# Altium schematic sheet Sheet5.SchDoc: solar-powered-remote-water-level-relay
size 419 x 297 mm; Date: 2026/06/29; Author: forlook88@gmail.com; Revision: 0; SheetNumber: 5; SheetTotal: 11
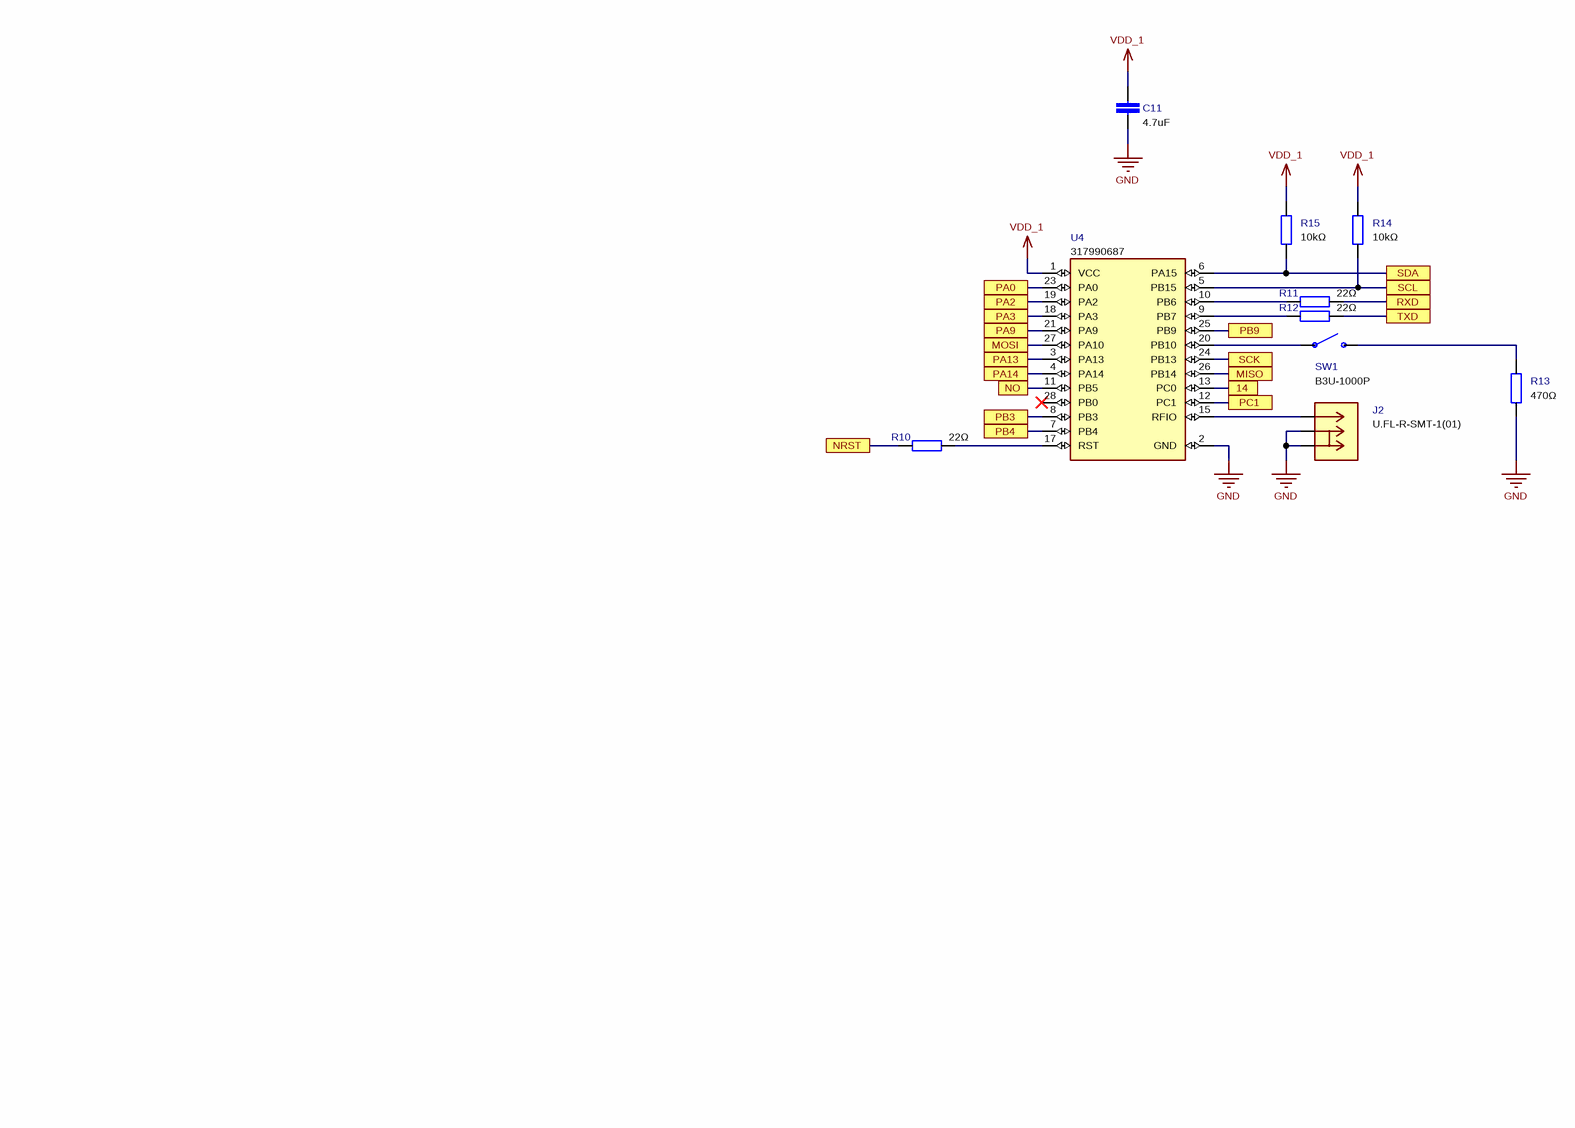
[diagram p0: Sheet5.SchDoc]

## Parts
C11  value 4.7uF
J2  value U.FL-R-SMT-1(01)
R10  value 22Ω
R11  value 22Ω
R12  value 22Ω
R13  value 470Ω
R14  value 10kΩ
R15  value 10kΩ
SW1  value B3U-1000P
U4  value 317990687

## Ports
14, MISO, MOSI, NO, NRST, PA0, PA2, PA3, PA9, PA13, PA14, PB3, PB4, PB9, PC1, RXD, SCK, SCL, SDA, TXD

## Nets
GND: C11.2 J2.2(GND_2) J2.3(GND) R13.1 U4.2(GND) U4.14(GND) U4.16(GND) U4.22(GND)
VDD_1: C11.1 R14.2 R15.2 U4.1(VCC)
14: U4.13(PC0) ; port 14
MISO: U4.26(PB14) ; port MISO
MOSI: U4.27(PA10) ; port MOSI
NO: U4.11(PB5) ; port NO
NRST: R10.2 ; port NRST
PA0: U4.23(PA0) ; port PA0
PA2: U4.19(PA2) ; port PA2
PA3: U4.18(PA3) ; port PA3
PA9: U4.21(PA9) ; port PA9
PA13: U4.3(PA13) ; port PA13
PA14: U4.4(PA14) ; port PA14
PB3: U4.8(PB3) ; port PB3
PB4: U4.7(PB4) ; port PB4
PB9: U4.25(PB9) ; port PB9
PC1: U4.12(PC1) ; port PC1
RXD: R11.1 ; port RXD
SCK: U4.24(PB13) ; port SCK
SCL: R14.1 U4.5(PB15) ; port SCL
SDA: R15.1 U4.6(PA15) ; port SDA
TXD: R12.1 ; port TXD
NetJ2_1: J2.1(SIGNAL) U4.15(RFIO)
NetR10_1: R10.1 U4.17(RST)
NetR11_2: R11.2 U4.10(PB6)
NetR12_2: R12.2 U4.9(PB7)
NetR13_2: R13.2 SW1.2(P$2)
NetSW1_1: SW1.1(P$1) U4.20(PB10)

Not connected (* = marked no-connect by the designer): U4 28(PB0)*

## Notes on the sheet
- Document Name:
- Project Name:
- Sheet Name:
- Sheet Number:
- Author:
- CELUS Design Platform electronic designs are machine-generated drafts and require verification by qualified specialists.
- of
- Revision:
- Date:
- By using these designs, you agree to the CELUS Terms of Use: https://www.celus.io/terms-of-use

## Library data of the parts
C11 = (no symbol name): Manufacturer Part Number: CM05X5R475M25AH; Manufacturer: KYOCERA
J2 = (no symbol name): Manufacturer: HIROSE; Manufacturer Part Number: U.FL-R-SMT-1(01)
R10-R12 = (no symbol name): Manufacturer Part Number: ERJ-2RKF22R0X; Manufacturer: PANASONIC
R13 = (no symbol name): Manufacturer Part Number: AC0402FR-7W470RL; Manufacturer: YAGEO
R14 R15 = (no symbol name): Manufacturer Part Number: SG73P1EWTTP1002F; Manufacturer: KOA SPEER
SW1 = (no symbol name): Manufacturer: Omron; Manufacturer Part Number: B3U-1000P
U4 = (no symbol name): Manufacturer: Seeed Studio; Manufacturer Part Number: 317990687